# EAGLE design schematic (EAGLE 8.6.3)

## Sheet 1 of 2: BIG PCB -NRF52832 WLCSP (WIRED)
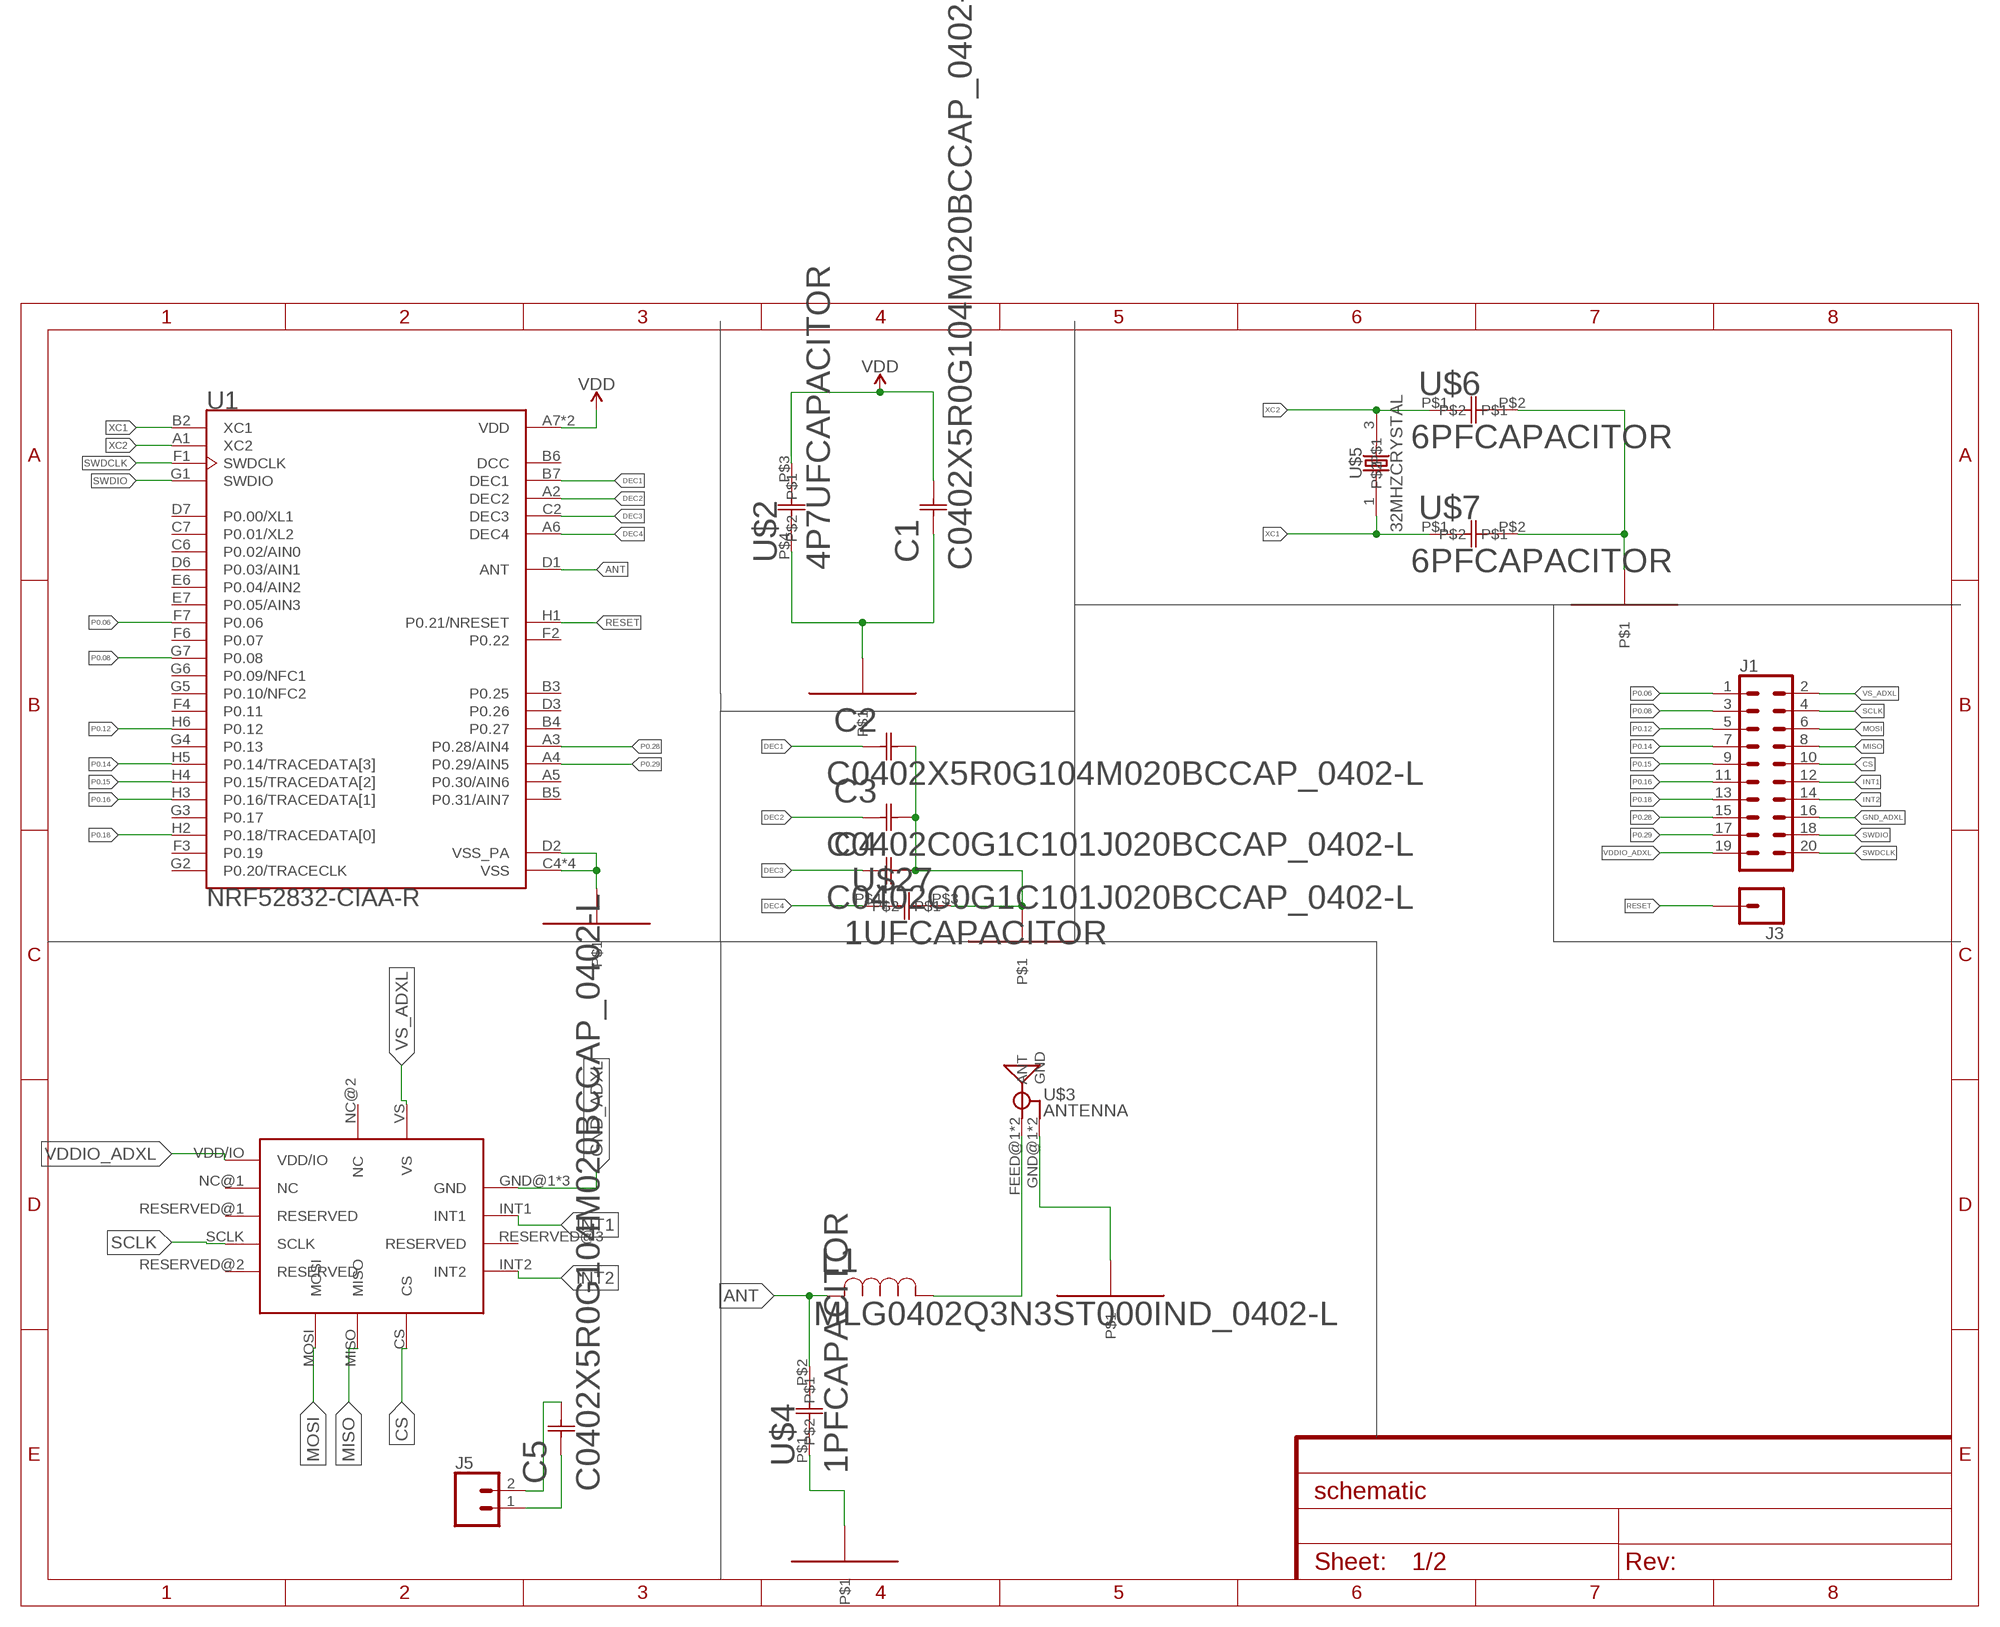
[diagram p0: schematic, sheet 1]

### Parts
C1  C0402X5R0G104M020BCCAP_0402-L  [CAP_0402-L]
C2  C0402X5R0G104M020BCCAP_0402-L  [CAP_0402-L]
C3  C0402C0G1C101J020BCCAP_0402-L  [CAP_0402-L]
C4  C0402C0G1C101J020BCCAP_0402-L  [CAP_0402-L]
C5  C0402X5R0G104M020BCCAP_0402-L  [CAP_0402-L]
J1  CONN_10X2  [2X10]
J3  CONN_01  [1X01]
J5  CONN_02  [1X02]
L1  MLG0402Q3N3ST000IND_0402-L  [IND_0402-L]
U1  NRF52832-CIAA-R  [BGA50N40P7X8_300X320X40]
U$1  ADXL362  [TFLGA-16/3.3MMX3.1MM]
U$2  4P7UFCAPACITOR  [4P7UFCAPACITOR]
U$3  ANTENNA  [ANTENNA_FOOTPRINT]
U$4  1PFCAPACITOR  [1PFCAPACITOR]
U$5  32MHZCRYSTAL  [32MHZCRYSTAL]
U$6  6PFCAPACITOR  [6PFCAPACITOR]
U$7  6PFCAPACITOR  [6PFCAPACITOR]
U$27  1UFCAPACITOR  [1UFCAPACITOR]

### Nets
ANT: L1.2 U1.D1(ANT) U$4.P$2
CS: J1.10 U$1.CS
DEC1: C2.1 U1.B7(DEC1)
DEC2: C3.1 U1.A2(DEC2)
DEC3: C4.1 U1.C2(DEC3)
DEC4: U1.A6(DEC4) U$27.P$4
GND_ADXL: J1.16 U$1.GND@1(GND) U$1.GND@2(GND) U$1.GND@3(GND)
INT1: J1.12 U$1.INT1
INT2: J1.14 U$1.INT2
MISO: J1.8 U$1.MISO
MOSI: J1.6 U$1.MOSI
N$1: L1.1 U$3.FEED@1(ANT) U$3.FEED@2(ANT)
N$3: C5.2 J5.2
N$4: C5.1 J5.1
P0.06: J1.1 U1.F7(P0.06)
P0.08: J1.3 U1.G7(P0.08)
P0.12: J1.5 U1.H6(P0.12)
P0.14: J1.7 U1.H5(P0.14/TRACEDATA[3])
P0.15: J1.9 U1.H4(P0.15/TRACEDATA[2])
P0.16: J1.11 U1.H3(P0.16/TRACEDATA[1])
P0.18: J1.13 U1.H2(P0.18/TRACEDATA[0])
P0.28: J1.15 U1.A3(P0.28/AIN4)
P0.29: J1.17 U1.A4(P0.29/AIN5)
P$1: C1.1 C2.2 C3.2 C4.2 U1.C4(VSS) U1.C5(VSS) U1.D2(VSS_PA) U1.E3(VSS) U1.F5(VSS) U$2.P$4 U$6.P$2 U$7.P$2 U$27.P$3 ; supply symbol labelled GND-SMALLPCB
RESET: J3.1 U1.H1(P0.21/NRESET)
SCLK: J1.4 U$1.SCLK
SWDCLK: J1.20 U1.F1(SWDCLK)
SWDIO: J1.18 U1.G1(SWDIO)
VDD: C1.2 U1.A7(VDD) U1.H7(VDD) U$2.P$3
VDDIO_ADXL: J1.19 U$1.VDD/IO
VS_ADXL: J1.2 U$1.VS
VSS_PA: U$3.GND@1(GND) U$3.GND@2(GND) U$4.P$1 ; supply symbol labelled GND-SMALLPCB
XC1: U1.B2(XC1) U$5.1 U$7.P$1
XC2: U1.A1(XC2) U$5.3 U$6.P$1
Unconnected: U1.A5(P0.30/AIN6) U1.B3(P0.25) U1.B4(P0.27) U1.B5(P0.31/AIN7) U1.C6(P0.02/AIN0) U1.C7(P0.01/XL2) U1.D3(P0.26) U1.D6(P0.03/AIN1) U1.D7(P0.00/XL1) U1.E6(P0.04/AIN2) U1.E7(P0.05/AIN3) U1.F2(P0.22) U1.F3(P0.19) U1.F4(P0.11) U1.F6(P0.07) U1.G2(P0.20/TRACECLK) U1.G3(P0.17) U1.G4(P0.13) U1.G5(P0.10/NFC2) U1.G6(P0.09/NFC1) U$1.NC@1(NC) U$1.NC@2(NC) U$1.RESERVED@1(RESERVED) U$1.RESERVED@2(RESERVED) U$1.RESERVED@3(RESERVED)

## Sheet 2 of 2
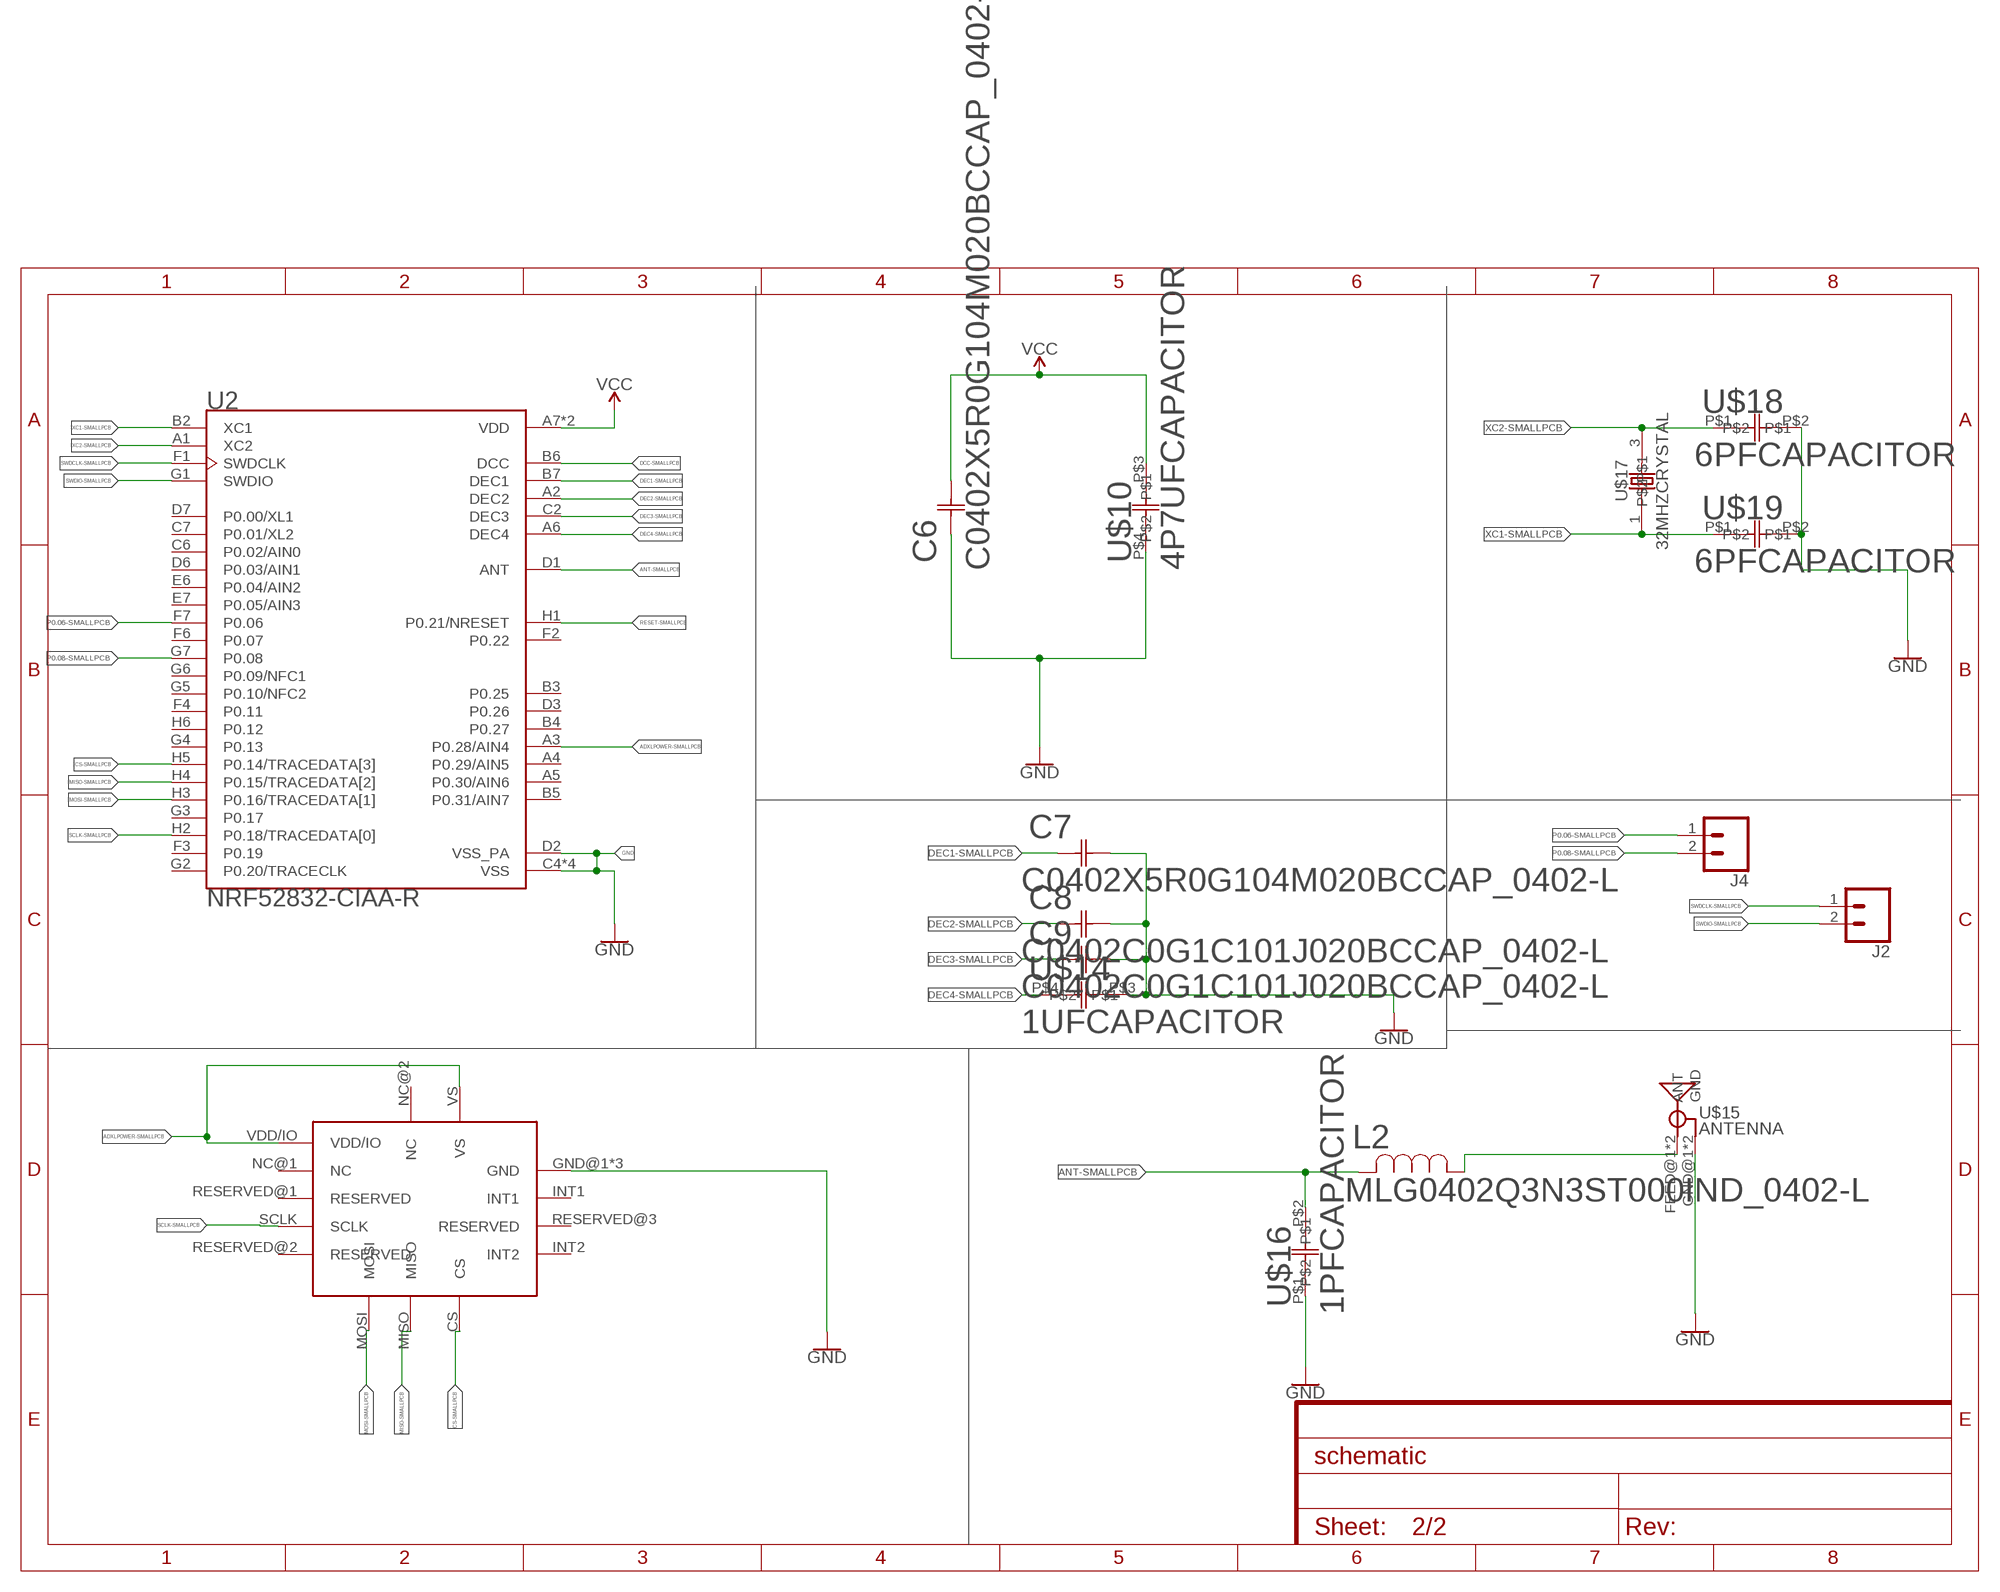
[diagram p1: schematic, sheet 2]

### Parts
C6  C0402X5R0G104M020BCCAP_0402-L  [CAP_0402-L]
C7  C0402X5R0G104M020BCCAP_0402-L  [CAP_0402-L]
C8  C0402C0G1C101J020BCCAP_0402-L  [CAP_0402-L]
C9  C0402C0G1C101J020BCCAP_0402-L  [CAP_0402-L]
J2  CONN_02  [1X02]
J4  CONN_02  [1X02]
L2  MLG0402Q3N3ST000IND_0402-L  [IND_0402-L]
U2  NRF52832-CIAA-R  [BGA50N40P7X8_300X320X40]
U$8  ADXL362  [TFLGA-16/3.3MMX3.1MM]
U$10  4P7UFCAPACITOR  [4P7UFCAPACITOR]
U$14  1UFCAPACITOR  [1UFCAPACITOR]
U$15  ANTENNA  [ANTENNA_FOOTPRINT]
U$16  1PFCAPACITOR  [1PFCAPACITOR]
U$17  32MHZCRYSTAL  [32MHZCRYSTAL]
U$18  6PFCAPACITOR  [6PFCAPACITOR]
U$19  6PFCAPACITOR  [6PFCAPACITOR]

### Nets
ADXLPOWER-SMALLPCB: U2.A3(P0.28/AIN4) U$8.VDD/IO U$8.VS
ANT-SMALLPCB: L2.2 U2.D1(ANT) U$16.P$2
CS-SMALLPCB: U2.H5(P0.14/TRACEDATA[3]) U$8.CS
DCC-SMALLPCB: U2.B6(DCC)
DEC1-SMALLPCB: C7.1 U2.B7(DEC1)
DEC2-SMALLPCB: C8.1 U2.A2(DEC2)
DEC3-SMALLPCB: C9.1 U2.C2(DEC3)
DEC4-SMALLPCB: U2.A6(DEC4) U$14.P$4
GND: C6.1 C7.2 C8.2 C9.2 U2.C4(VSS) U2.C5(VSS) U2.D2(VSS_PA) U2.E3(VSS) U2.F5(VSS) U$8.GND@1(GND) U$8.GND@2(GND) U$8.GND@3(GND) U$10.P$4 U$14.P$3 U$15.GND@1(GND) U$15.GND@2(GND) U$16.P$1 U$18.P$2 U$19.P$2
MISO-SMALLPCB: U2.H4(P0.15/TRACEDATA[2]) U$8.MISO
MOSI-SMALLPCB: U2.H3(P0.16/TRACEDATA[1]) U$8.MOSI
N$2: L2.1 U$15.FEED@1(ANT) U$15.FEED@2(ANT)
P0.06-SMALLPCB: J4.1 U2.F7(P0.06)
P0.08-SMALLPCB: J4.2 U2.G7(P0.08)
RESET-SMALLPCB: U2.H1(P0.21/NRESET)
SCLK-SMALLPCB: U2.H2(P0.18/TRACEDATA[0]) U$8.SCLK
SWDCLK-SMALLPCB: J2.1 U2.F1(SWDCLK)
SWDIO-SMALLPCB: J2.2 U2.G1(SWDIO)
VCC: C6.2 U2.A7(VDD) U2.H7(VDD) U$10.P$3
XC1-SMALLPCB: U2.B2(XC1) U$17.1 U$19.P$1
XC2-SMALLPCB: U2.A1(XC2) U$17.3 U$18.P$1
Unconnected: U2.A4(P0.29/AIN5) U2.A5(P0.30/AIN6) U2.B3(P0.25) U2.B4(P0.27) U2.B5(P0.31/AIN7) U2.C6(P0.02/AIN0) U2.C7(P0.01/XL2) U2.D3(P0.26) U2.D6(P0.03/AIN1) U2.D7(P0.00/XL1) U2.E6(P0.04/AIN2) U2.E7(P0.05/AIN3) U2.F2(P0.22) U2.F3(P0.19) U2.F4(P0.11) U2.F6(P0.07) U2.G2(P0.20/TRACECLK) U2.G3(P0.17) U2.G4(P0.13) U2.G5(P0.10/NFC2) U2.G6(P0.09/NFC1) U2.H6(P0.12) U$8.INT1 U$8.INT2 U$8.NC@1(NC) U$8.NC@2(NC) U$8.RESERVED@1(RESERVED) U$8.RESERVED@2(RESERVED) U$8.RESERVED@3(RESERVED)

## Power pins joined to a net without a drawn wire
DCC: U1.B6(DCC)

## Library data of the parts
C1 C2 C5-C7 = 0p1_uF_capacitor:C0402X5R0G104M020BC; MANUFACTURER_PART_NUMBER: C0402C0G1C101J020BC; VENDOR: TDK
C3 C4 C8 C9 = 100_pF_capacitor:C0402C0G1C101J020BC; MANUFACTURER_PART_NUMBER: C0402C0G1C101J020BC; VENDOR: TDK
J1 = SparkFun-Connectors:CONN_10X2: Multi connection point. Often used as Generic Header-pin footprint for 0.1 inch spaced/style header connections On any of the 0.1 inch spaced packages, you can populate with these: Break Away Headers - Straight <https://www.sparkfun.com/products/116> (PRT-00116) Break Away Male Headers - Right Angle <https://www.sparkfun.com/products/553> (PRT-00553) Female Headers <https://www.sparkfun.com/products/115> (PRT-00115) Break Away Headers - Machine Pin <https://www.sparkfun.com/products/117> (PRT-00117) Break Away Female Headers - Swiss Machine Pin <https://www.sparkfun.com/products/743> (PRT-00743) Special note about the "SPECIAL" package: This was SPECIALLY designed to be used with our Graphic LCD Backpack. Be sure you want to use this! It is not only staggered on each line of header holes, but IT IS ALSO offset of the center point of the top and bottom lines by 5 mil. This causes the headers to lock into place on the "standard" footprint on the LCD screen. The extra squares on the tdocu layer are there simply to reference other pins (if you were to actually populate a longer header than ten long - this is what we do with the backpacks).
J2 J4 J5 = SparkFun-Connectors:CONN_02: Multi connection point. Often used as Generic Header-pin footprint for 0.1 inch spaced/style header connections On any of the 0.1 inch spaced packages, you can populate with these: Break Away Headers - Straight <https://www.sparkfun.com/products/116> (PRT-00116) Break Away Male Headers - Right Angle <https://www.sparkfun.com/products/553> (PRT-00553) Female Headers <https://www.sparkfun.com/products/115> (PRT-00115) Break Away Headers - Machine Pin <https://www.sparkfun.com/products/117> (PRT-00117) Break Away Female Headers - Swiss Machine Pin <https://www.sparkfun.com/products/743> (PRT-00743) For SCREWTERMINALS and SPRING TERMINALS visit here: Screw Terimnals on SparkFun.com <https://www.sparkfun.com/search/results?term=Screw+Terminals> (5mm/3.5mm/2.54mm spacing) This device is also useful as a general connection point to wire up your design to another part of your project. Our various solder wires solder well into these plated through hole pads. Hook-Up Wire - Assortment (Stranded, 22 AWG) <https://www.sparkfun.com/products/11375> (PRT-11375) Hook-Up Wire - Assortment (Solid Core, 22 AWG) <https://www.sparkfun.com/products/11367> (PRT-11367) View the entire wire category on our website here <https://www.sparkfun.com/categories/141> Special notes: Molex polarized connector foot print use with: PRT-08233 with associated crimp pins and housings. 2.54_SCREWTERM for use with PRT-10571. 3.5mm Screw Terminal footprints for PRT-08084 5mm Screw Terminal footprints for use with PRT-08432
J3 = SparkFun-Connectors:CONN_01: Single connection point. Often used as Generic Header-pin footprint for 0.1 inch spaced/style header connections On any of the 0.1 inch spaced packages, you can populate with these: Break Away Headers - Straight <https://www.sparkfun.com/products/116> (PRT-00116) Break Away Male Headers - Right Angle <https://www.sparkfun.com/products/553> (PRT-00553) Female Headers <https://www.sparkfun.com/products/115> (PRT-00115) Break Away Headers - Machine Pin <https://www.sparkfun.com/products/117> (PRT-00117) Break Away Female Headers - Swiss Machine Pin <https://www.sparkfun.com/products/743> (PRT-00743) This device is also useful as a general connection point to wire up your design to another part of your project. Our various solder wires solder well into these plated through hole pads. Hook-Up Wire - Assortment (Stranded, 22 AWG) <https://www.sparkfun.com/products/11375> (PRT-11375) Hook-Up Wire - Assortment (Solid Core, 22 AWG) <https://www.sparkfun.com/products/11367> (PRT-11367) View the entire wire category on our website here <https://www.sparkfun.com/categories/141> Special notes: SMTSO-256-ET is a "flush mount" nut for a 4-40 screw. We mostly use this on specialty testbeds; it is a nice way to connect hardware to your PCB at an adjustable hieght. Also note, the SNAP packages are for using a snappable style connector. We sell a baggie of snaps and they are also used on two LilyPad designs: Snap Assortment - 30 pack (male and female) <https://www.sparkfun.com/products/11347> (DEV-11347) LilyPad Arduino SimpleSnap <https://www.sparkfun.com/products/10941> (DEV-10941) LilyPad SimpleSnap Protoboard <https://www.sparkfun.com/products/10940> (DEV-10940)
L1 L2 = 3p3_nH_inductor:MLG0402Q3N3ST000; MANUFACTURER_PART_NUMBER: MLG0402Q3N3ST000; VENDOR: TDK
U1 U2 = NRF52832-CIAA-R:NRF52832-CIAA-R: Multi Protocal Bluetooth Smart ANT 2.4GHz RF SoC (WL-CSP); AVAILABILITY: Good; DESCRIPTION: IC RF TXRX+MCU BLUETOOTH 50WLCSP; MF: Nordic; MP: NRF52832-CIAA-R; PACKAGE: XFBGA-50 Nordic Semiconductor; PRICE: 3.87 USD
U$1 U$8 = ADXL362:ADXL362
U$2 U$10 = 4p7_uF_capacitor:4P7UFCAPACITOR
U$3 U$15 = 2p4_ghz_antenna:ANTENNA
U$4 U$16 = 1_pF_capacitor:1PFCAPACITOR
U$5 U$17 = 32_mhz_crystal:32MHZCRYSTAL
U$6 U$7 U$18 U$19 = 6_pF_capacitor:6PFCAPACITOR
U$14 U$27 = 1_uF_capacitor:1UFCAPACITOR

## Board
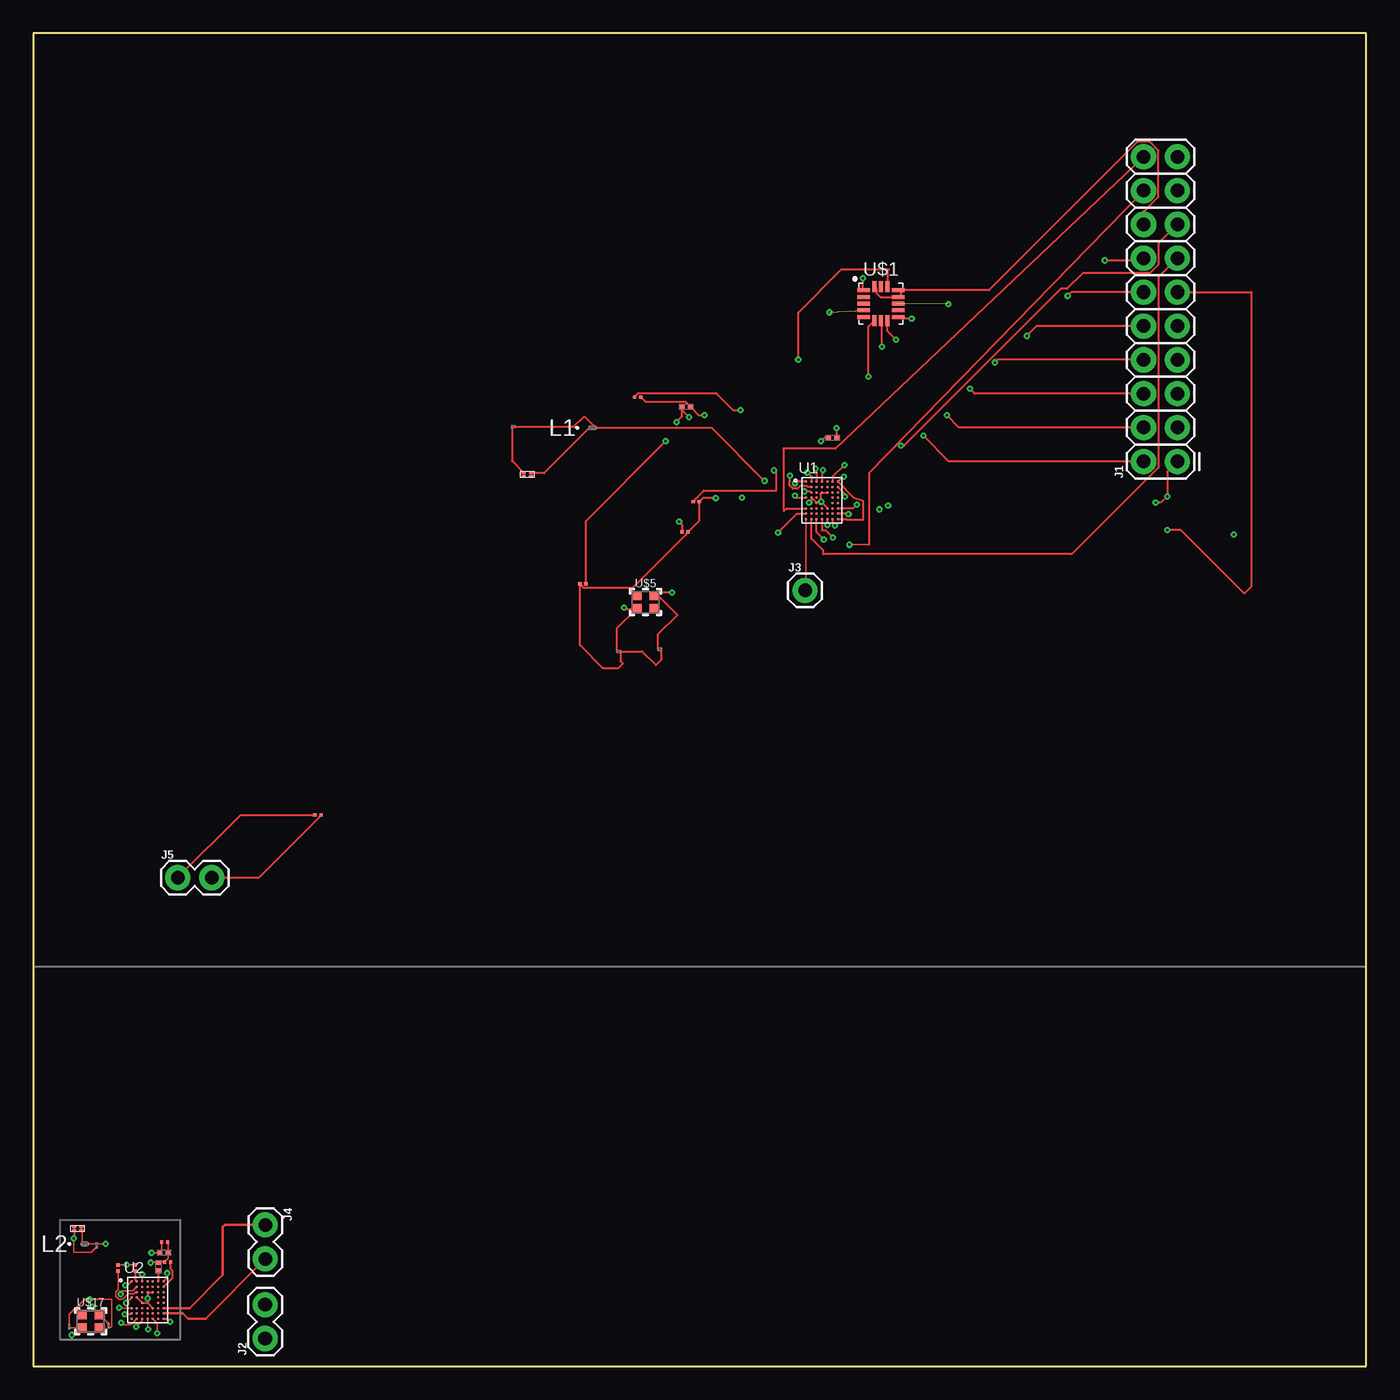
[diagram p2: board, top side]
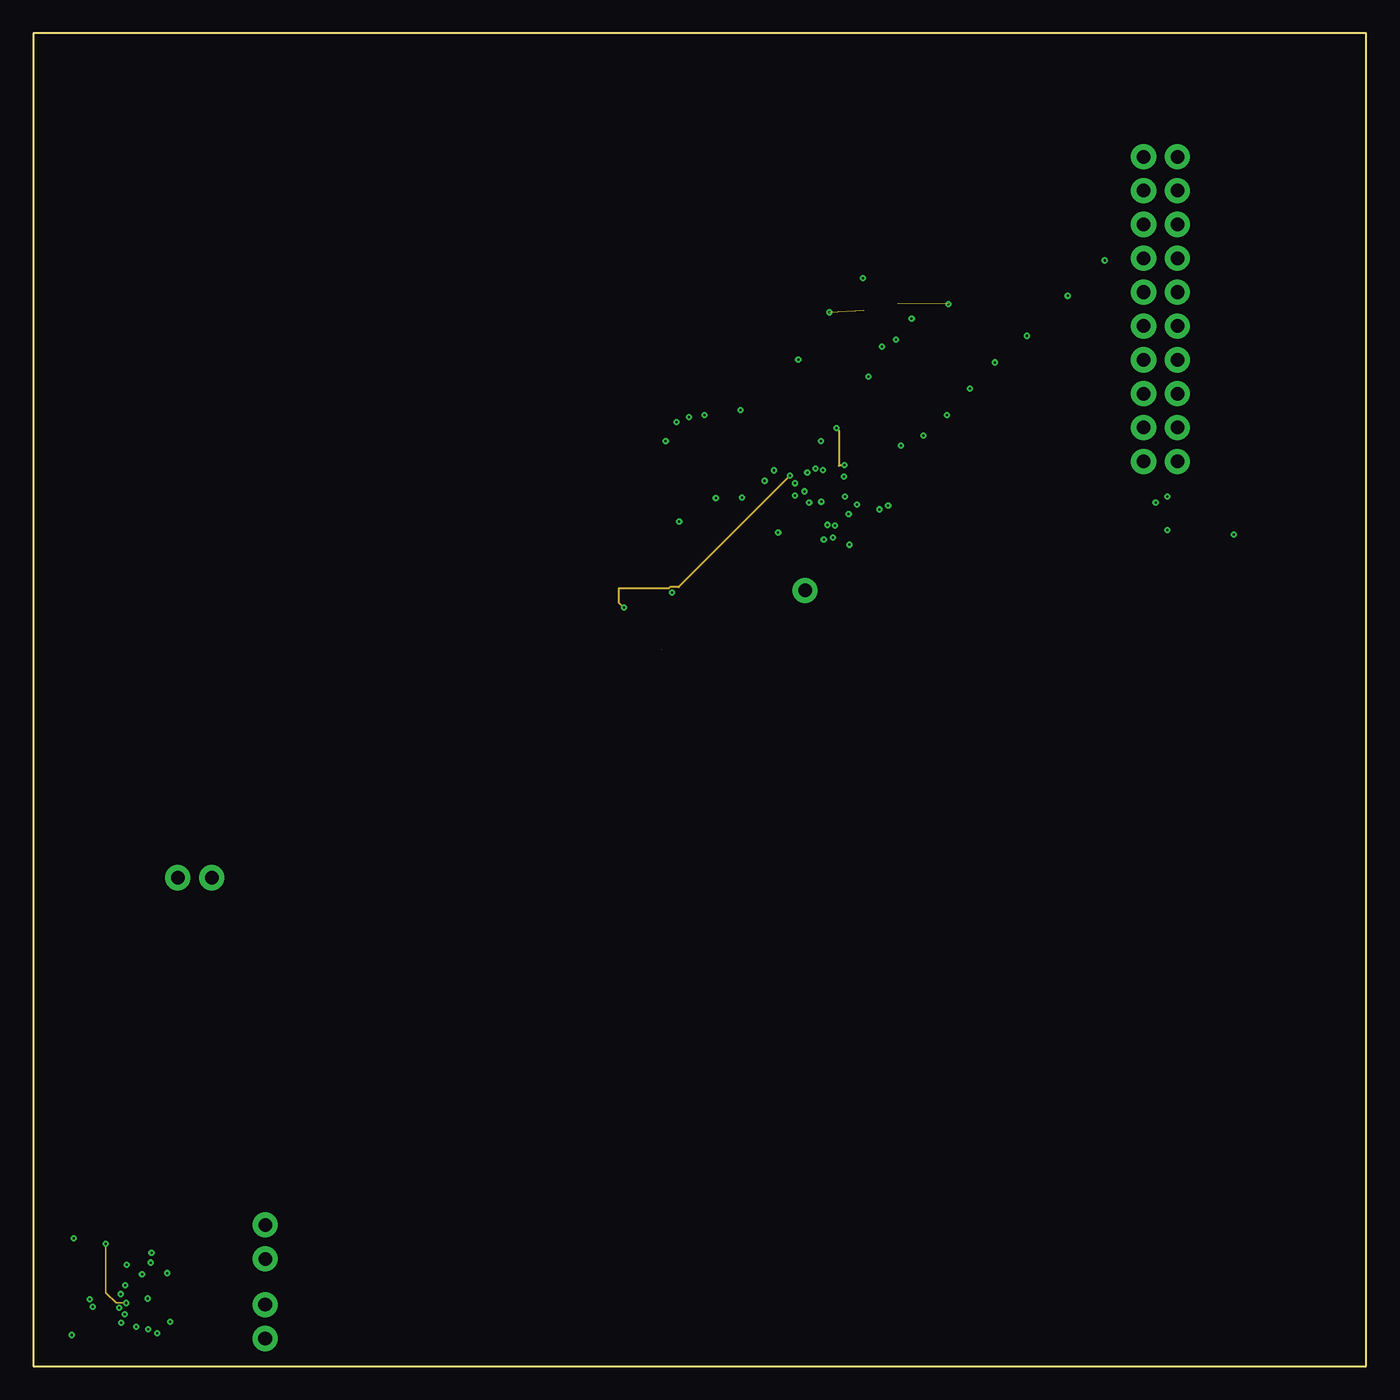
[diagram p3: board, inner layer Route4]
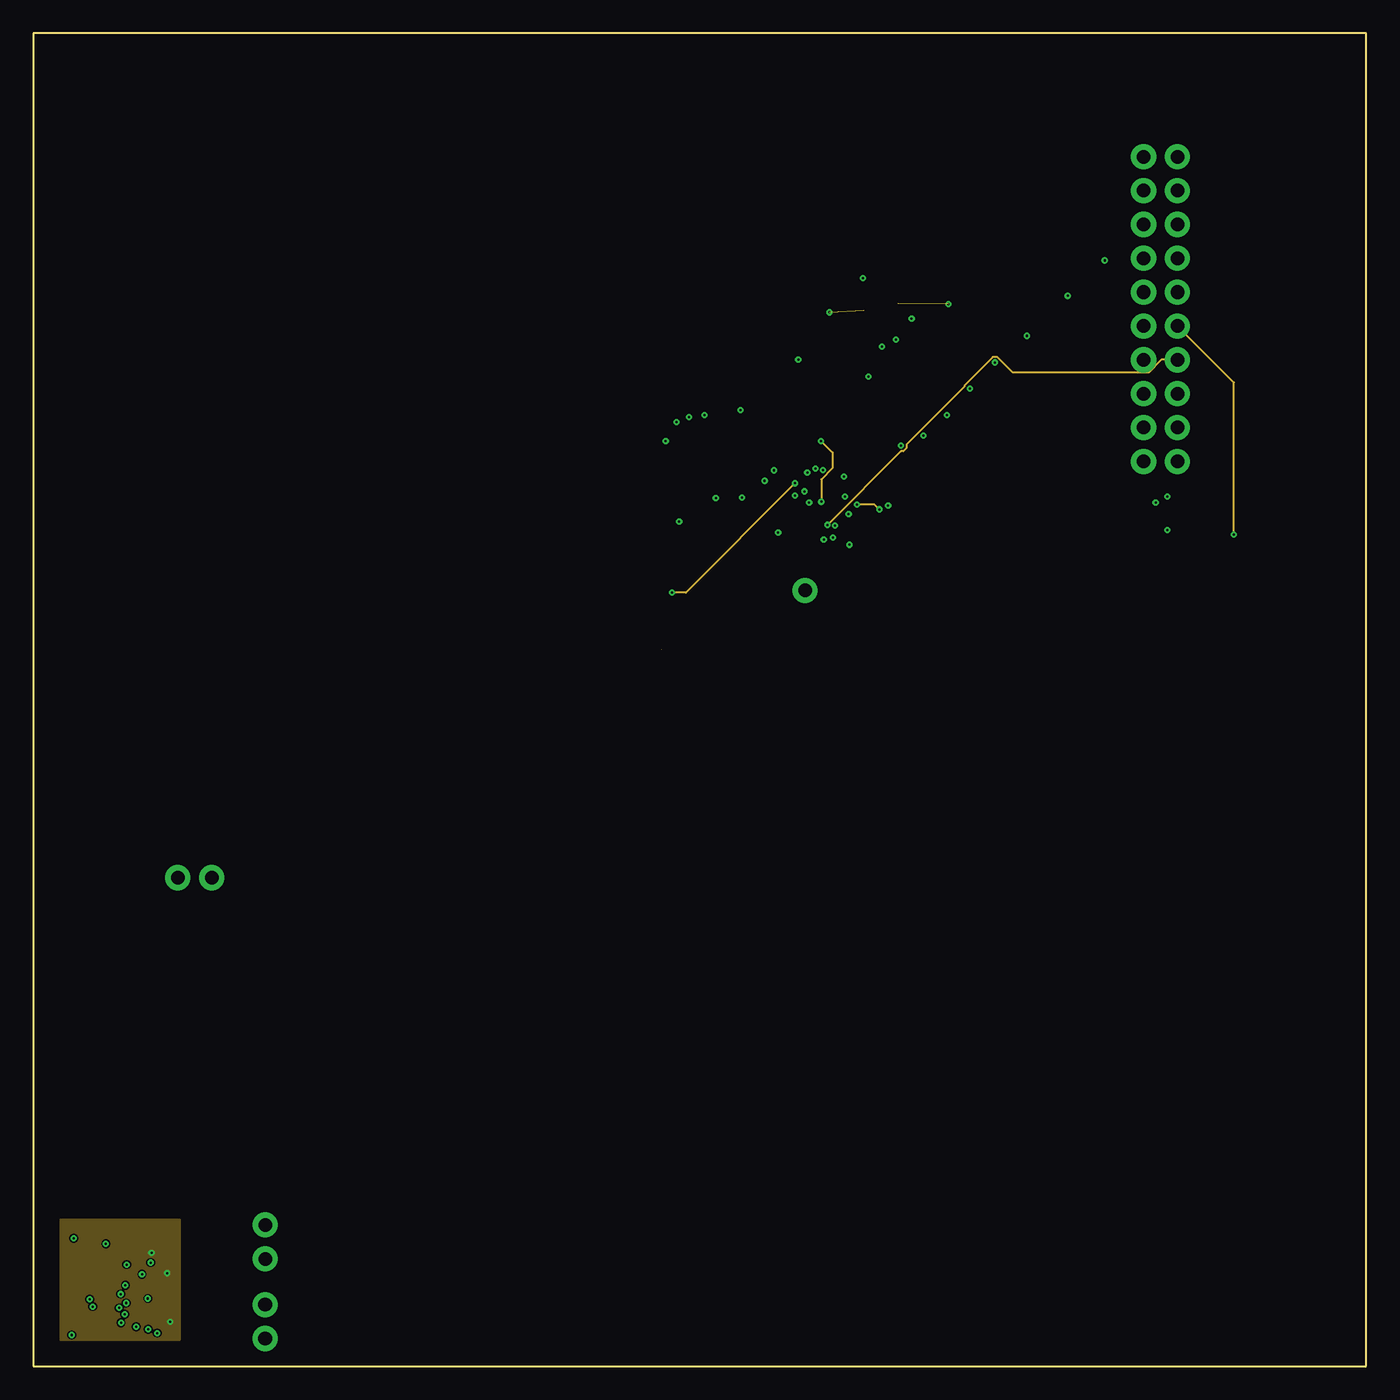
[diagram p4: board, inner layer Route8]
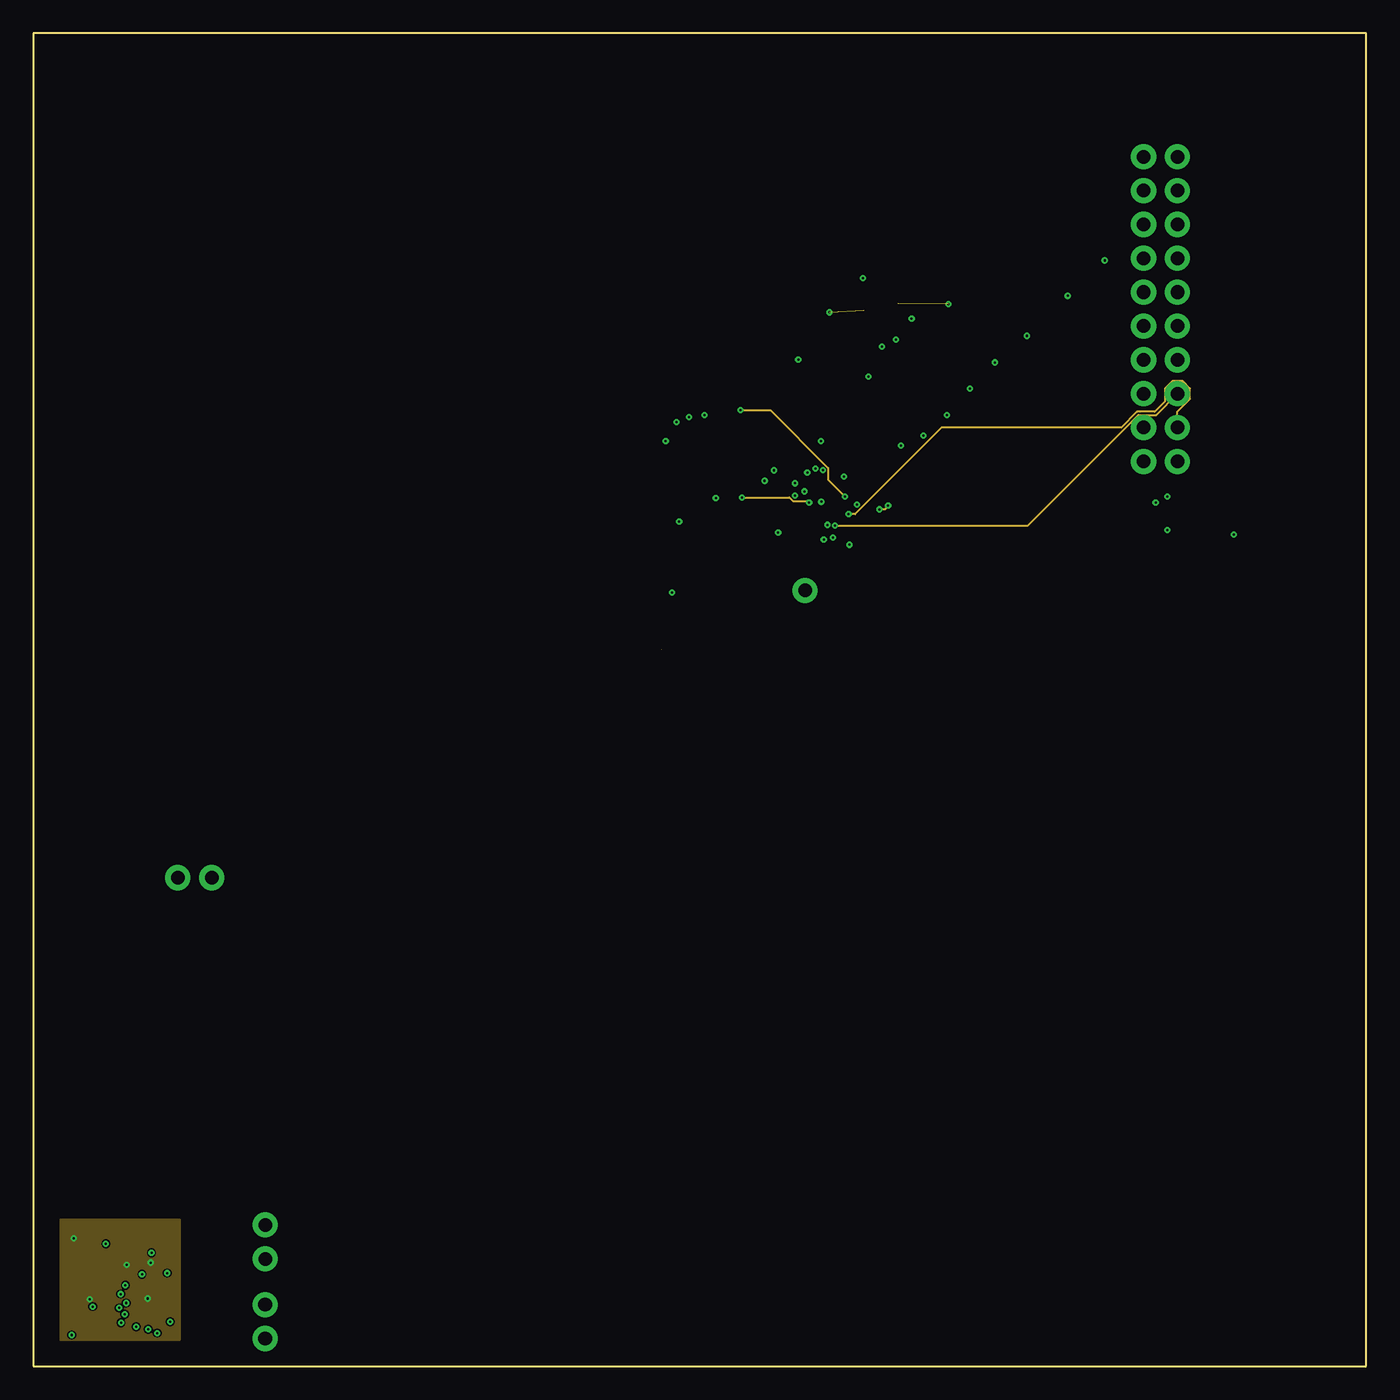
[diagram p5: board, inner layer Route10]
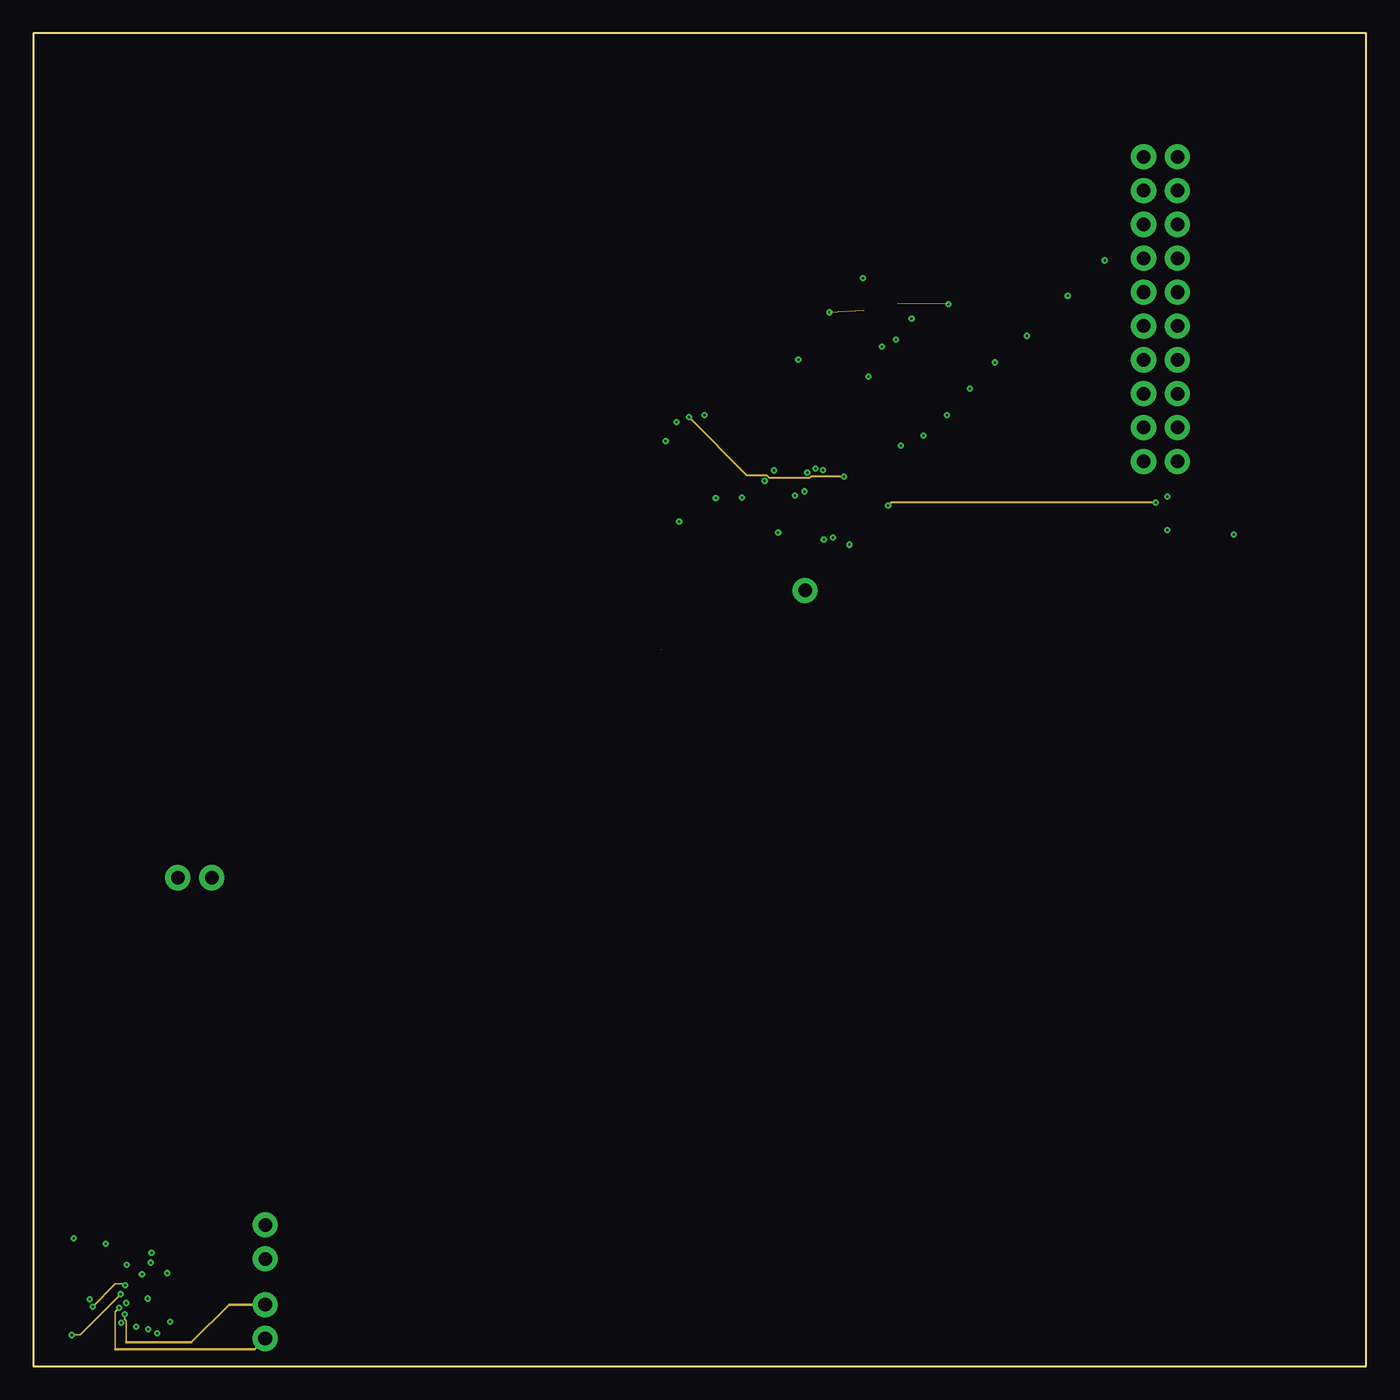
[diagram p6: board, inner layer Route12]
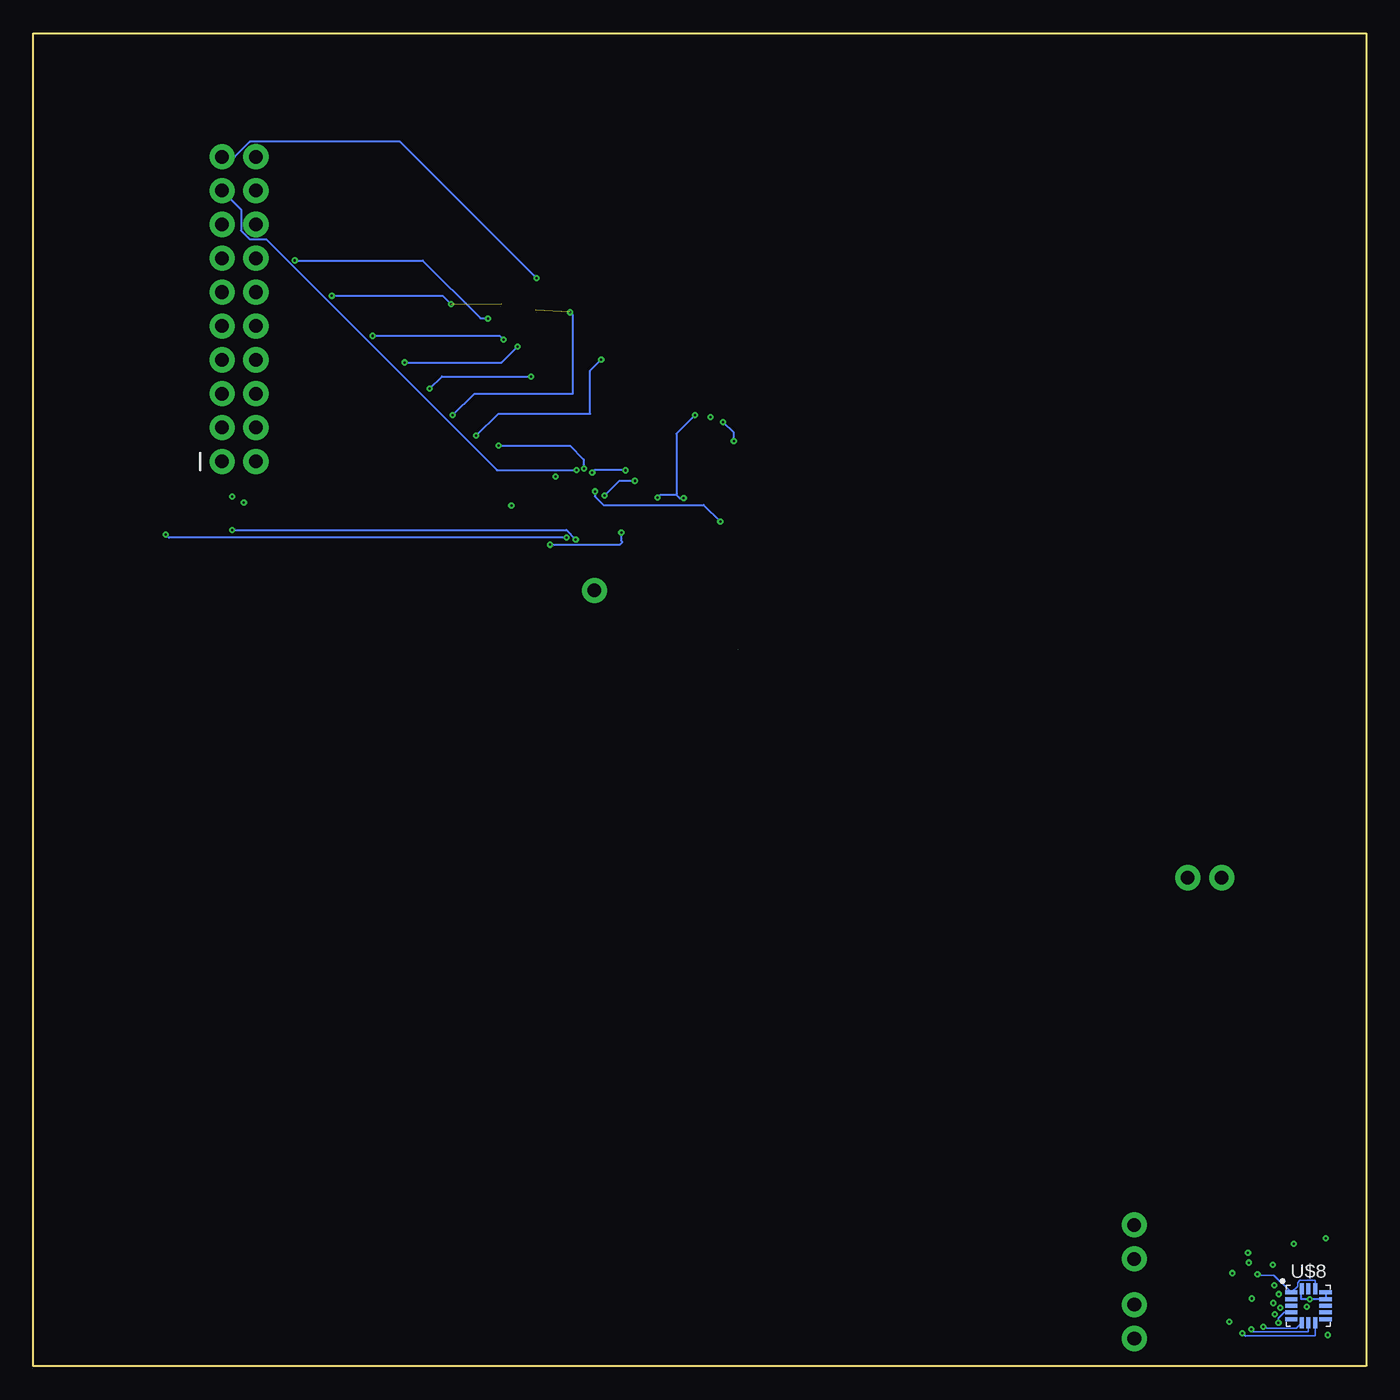
[diagram p7: board, bottom side, seen from below]

Size 100 x 100 mm. Coordinates in mm from the lower left corner, seen from the top.
Outline: 0,0 100,0 100,100 0,100 0,0
Copper layers (((1*4)*8*10)*(12*16)): Top 0.035mm / dielectric 0.25mm / Route4 0.035mm / dielectric 0.31mm / Route8 0.035mm / dielectric 0.15mm / Route10 0.035mm / dielectric 0.15mm / Route12 0.035mm / dielectric 0.15mm / Bottom 0.035mm
Design rules "default *": minimum track width 4mil, minimum drill 6mil, track to track 4mil, track to pad 4mil, pad to pad 4mil, via to via 4mil, smd to smd 2mil, copper to edge 40mil, drill to drill 6mil, minimum pad ring 10mil, minimum via ring 6mil, stop-mask expansion 4mil, vias tented up to drill 0mil, thermal gap 10mil

### Footprints (pad centres in the part's own frame; a part is rotated, then mirrored left to right if it is on the bottom)
CAP_0402-L = smd 0.25 x 0.25: 1 -0.229,0; 2 0.229,0
2X10 = drill 1.016 pad 1.88: 1 0,0; 2 0,2.54; 3 2.54,0; 4 2.54,2.54; 5 5.08,0; 6 5.08,2.54; 7 7.62,0; 8 7.62,2.54; 9 10.16,0; 10 10.16,2.54; 11 12.7,0; 12 12.7,2.54; 13 15.24,0; 14 15.24,2.54; 15 17.78,0; 16 17.78,2.54; 17 20.32,0; 18 20.32,2.54; 19 22.86,0; 20 22.86,2.54
1X02 = drill 1.016 pad 1.88: 1 0,0; 2 2.54,0
1X01 = drill 1.016 pad 1.88: 1 0,0
IND_0402-L = smd 0.212 x 0.2: 1 -0.196,0; 2 0.196,0
BGA50N40P7X8_300X320X40 = smd 0.2 x 0.2: A1 -1.2,1.4; A2 -0.8,1.4; A3 -0.4,1.4; A4 0,1.4; A5 0.4,1.4; A6 0.8,1.4; A7 1.2,1.4; B2 -0.8,1; B3 -0.4,1; B4 0,1; B5 0.4,1; B6 0.8,1; B7 1.2,1; C2 -0.8,0.6; C3 -0.4,0.6; C4 0,0.6; C5 0.4,0.6; C6 0.8,0.6; C7 1.2,0.6; D1 -1.2,0.2; D2 -0.8,0.2; D3 -0.4,0.2; D6 0.8,0.2; D7 1.2,0.2; E3 -0.4,-0.2; E6 0.8,-0.2; E7 1.2,-0.2; F1 -1.2,-0.6; F2 -0.8,-0.6; F3 -0.4,-0.6; F4 0,-0.6; F5 0.4,-0.6; F6 0.8,-0.6; F7 1.2,-0.6; G1 -1.2,-1; G2 -0.8,-1; G3 -0.4,-1; G4 0,-1; G5 0.4,-1; G6 0.8,-1; G7 1.2,-1; H1 -1.2,-1.4; H2 -0.8,-1.4; H3 -0.4,-1.4; H4 0,-1.4; H5 0.4,-1.4; H6 0.8,-1.4; H7 1.2,-1.4
TFLGA-16/3.3MMX3.1MM = smd 0.3 x 0.8: CS 0.5,-1.275; GND@3 -0.5,1.275; MISO 0,-1.275; MOSI -0.5,-1.275; NC@2 0,1.275; VS 0.5,1.275 | smd 0.925 x 0.3: GND@1 1.288,0.5; GND@2 1.288,1; INT1 1.288,0; INT2 1.288,-1; NC@1 -1.288,0.5; RESERVED@1 -1.288,0; RESERVED@2 -1.288,-1; RESERVED@3 1.288,-0.5; SCLK -1.288,-0.5; VDD/IO -1.288,1
4P7UFCAPACITOR = smd 0.35 x 0.4: P$3 0.18,0.15; P$4 0.8,0.15
ANTENNA_FOOTPRINT = smd 0.3 x 0.2: FEED@1 0.77,0.1; FEED@2 0.77,0.4; GND@1 0.23,0.1; GND@2 0.23,0.4
1PFCAPACITOR = smd 0.125 x 0.15: P$1 0.034,0.075; P$2 0.27,0.075
32MHZCRYSTAL = smd 0.75 x 0.7: 1 0.485,0.47; 2 1.835,0.47; 3 1.835,1.47; 4 0.485,1.47
6PFCAPACITOR = smd 0.125 x 0.15: P$1 0.034,0.075; P$2 0.27,0.075
1UFCAPACITOR = smd 0.35 x 0.4: P$3 0.18,0.15; P$4 0.8,0.15

### Placement (x,y rotation side)
C1  41.23,58.71 0 top
C2  45.34,72.71 0 top
C3  49.74,64.87 0 top
C4  48.9,62.59 0 top
C5  21.36,41.35 0 top
C6  9.86,9.32 180 top
C7  10.08,7.82 180 top
C8  7.65,7.37 90 top
C9  6.35,7.37 90 top
J1  85.84,67.88 90 top
J2  17.39,2.07 90 top
J3  57.91,58.21 0 top
J4  17.41,10.59 270 top
J5  10.85,36.65 0 top
L1  41.94,70.41 0 top
L2  3.85,9.18 0 top
U1  59.17,64.96 0 top
U2  8.56,4.96 0 top
U$1  63.6,79.71 0 top
U$2  48.5,71.83 0 top
U$3  36.56,66.65 0 top
U$4  35.87,70.41 0 top
U$5  44.77,56.35 0 top
U$6  46.85,53.71 0 top
U$7  43.77,53.56 0 top
U$8  4.33,4.53 0 bottom
U$10  9.32,8.37 0 top
U$14  9.24,7.96 270 top
U$15  2.82,10.08 0 top
U$16  4.82,8.92 90 top
U$17  3.14,2.4 0 top
U$18  5.58,3.17 270 top
U$19  2.76,2.83 90 top
U$27  59.48,69.5 0 top

### Tracks (layer width: path | path; a pad name or v marks a point on that pad's centre or on a via)
ADXLPOWER-SMALLPCB  (via drill 0.15 pad 0.46)
  Top 0.102: v8.15,6.88 8.16,6.87 U2.A3
  Bottom 0.102: U$8.VS 3.83,6.42 3.83,6.43 4.97,6.43 5.13,6.26 5.13,6.01 U$8.VDD/IO 6.93,6.83 8.1,6.83 v8.15,6.88
ANT  (via drill 0.15)
  Top 0.152: U$4.P$2 40.55,70.48 41.3,71.24 41.37,71.24 42.03,70.58 42.03,70.51 L1.2 50.89,70.41 v54.87,66.42 | v57.15,65.33 57.32,65.16 U1.D1
  Bottom 0.152: v54.87,66.42 56.06,66.42 v57.15,65.33
ANT-SMALLPCB  (via drill 0.15)
  Top 0.102: L2.2 4.73,9.18 U$16.P$2 v5.45,9.19 | U2.D1 7.36,5.14 v6.96,4.74
  Route4 0.102: v6.96,4.74 6.62,4.74 6.61,4.75 6.29,4.75 6.21,4.75 5.45,5.51 v5.45,9.19
CS  (via drill 0.15)
  Top 0.152: J1.10 75.27,78.04 v74.53,77.3 | v64.73,77.02 64.1,77.65 U$1.CS
  Bottom 0.152: v74.53,77.3 65.02,77.3 v64.73,77.02
CS-SMALLPCB  (via drill 0.15)
  Top 0.127: v9.3,2.48 9.3,3.22 U2.H5
  Bottom 0.127: U$8.CS 3.83,2.27 3.84,2.27 9.03,2.27 9.04,2.26 9.26,2.48 v9.3,2.48
DEC1  (via drill 0.15 layers 1-10)
  Top 0.152: C2.1 45.27,72.86 45.27,72.91 45.38,73.02 51.22,73.02 52.51,71.73 v53.05,71.73 | v60.89,65.26 60.89,65.44 U1.B7
  Route10 0.152: v60.89,65.26 59.64,66.51 59.64,67.39 55.3,71.73 v53.05,71.73
DEC1-SMALLPCB
  Top 0.152: C7.1 10.31,7.3 10.45,7.16 10.45,6.65 U2.B7
DEC2  (via drill 0.15)
  Top 0.152: C3.1 49.67,65.03 49.67,65.07 50.31,65.71 55.75,65.71 55.75,67.04 v55.58,67.21 | v58.07,67.05 58.37,66.75 U1.A2
  Bottom 0.152: v55.58,67.21 57.91,67.21 v58.07,67.05
DEC2-SMALLPCB
  Top 0.152: C8.1 7.64,6.48 U2.A2
DEC3  (via drill 0.15)
  Top 0.152: U1.C2 58.3,65.64 v57.87,65.64 | v48.46,63.35 48.67,63.15 C4.1
  Bottom 0.152: v57.87,65.64 57.87,65.25 57.23,64.61 49.72,64.61 v48.46,63.35
DEC3-SMALLPCB
  Top 0.102: U2.C2 7.65,5.56 7.53,5.44 7.12,5.44 6.71,5.03 6.39,5.03 6.17,5.25 6.17,5.57 6.35,5.75 C9.1
DEC4  (via drill 0.15 layers 1-4)
  Top 0.152: U$27.P$4 60.28,70.33 v60.25,70.37 | v60.84,67.61 59.97,66.74 U1.A6
  Route4 0.152: v60.25,70.37 60.44,70.18 60.44,67.53 60.51,67.61 v60.84,67.61
DEC4-SMALLPCB
  Top 0.152: U$14.P$4 9.36,7.13 U2.A6
GND  (via drill 0.15, 0.15 pad 0.46)
  Top 0.102: U$18.P$2 5.68,2.92 5.8,2.92 5.89,3.01 5.89,5.02 5.89,5.03 v4.24,5.03 | v4.24,5.03 | U$19.P$2 2.69,3.88 3.19,4.37 3.21,4.37 3.86,5.03 v4.24,5.03 | C8.2 7.62,7.62 v7.01,7.62 6.99,7.59 C9.2 | v8.81,7.77 v8.82,7.78 U$14.P$3 9.43,7.82 C7.2 10.04,8 10.04,8.01 10.12,8.1 U$10.P$4 10.12,9.28 C6.1 | U$16.P$1 4.33,8.54 4.03,8.54 3.98,8.54 3.05,8.54 3.02,8.57 3.04,8.59 v3.04,9.59
  Top 0.152: 8.56,4.76 U2.E3 U2.D2 | 8.56,4.76 U2.F5 | U2.C5 U2.C4 8.56,4.97 | 8.56,4.97 8.56,4.76 | 8.56,4.97 8.6,5 v8.6,5.08 | U$15.GND@2 U$15.GND@1 3.05,9.6 v3.04,9.59
  Route10 0.152: v8.6,5.08 8.67,5.08 | v3.04,9.59
  Bottom 0.152: U$8.GND@2 U$8.GND@1 v4.24,5.03 4.86,5.03 4.88,5.04 4.88,5.76 U$8.GND@3
  pour Route10: 2,2 11,2 11,11 2,11
GND_ADXL
  Top 0.152: 65.11,80.72 71.69,80.72 82.84,91.86 83.77,91.86 84.42,91.2 84.42,87.74 83.3,86.62 J1.16 | 65.11,80.72 U$1.GND@2 | 65.11,80.72 65.11,80.44 U$1.GND@1 63.57,80.22 63.27,80.52 63.27,80.82 U$1.GND@3
INT1  (via drill 0.15)  (1 unrouted)
  Top 0.152: J1.12 77.88,80.58 v77.6,80.3
  Bottom 0.152: v77.6,80.3 69.3,80.3 v68.67,79.68
INT2  (via drill 0.15)
  Top 0.152: J1.14 83.14,82.96 v80.38,82.96 | v65.9,78.59 65.01,78.59 U$1.INT2
  Bottom 0.152: v80.38,82.96 70.79,82.96 66.45,78.62 65.93,78.62 v65.9,78.59
MISO  (via drill 0.15)
  Top 0.152: J1.8 72.35,75.5 v72.16,75.31 | v63.68,76.5 63.68,78.36 U$1.MISO
  Bottom 0.152: v72.16,75.31 64.87,75.31 v63.68,76.5
MISO-SMALLPCB  (via drill 0.15 pad 0.46)
  Top 0.102: v8.61,2.77 8.56,2.81 U2.H4
  Bottom 0.102: U$8.MISO 4.33,2.58 4.34,2.56 8.59,2.56 8.61,2.59 v8.61,2.77
MOSI  (via drill 0.15)
  Top 0.152: J1.6 70.64,72.96 v70.26,73.33 | v62.65,74.26 62.65,78 U$1.MOSI
  Bottom 0.152: v70.26,73.33 69.34,74.26 v62.65,74.26
MOSI-SMALLPCB  (via drill 0.15 pad 0.46)
  Top 0.102: v7.72,2.95 8.16,3.39 U2.H3
  Bottom 0.102: U$8.MOSI 5.24,2.85 7.44,2.85 7.54,2.95 v7.72,2.95
N$1
  Top 0.152: U$3.FEED@2 37.33,66.99 | 37.33,66.99 U$3.FEED@1 | L1.1 38.33,66.99 37.33,66.99
N$2
  Top 0.102: U$15.FEED@2 U$15.FEED@1 3.65,10.11 L2.1
N$3
  Top 0.152: C5.2 21.44,41.2 21.44,41.15 16.93,36.65 J5.2
N$4
  Top 0.152: J5.1 15.54,41.35 C5.1
P0.06  (via drill 0.15, 0.15 layers 1-10)
  Top 0.152: J1.1 85.07,67.11 v85.07,65.26 84.61,64.79 v84.2,64.79 | v61.78,64.64 61.51,64.36 U1.F7
  Route8 0.152: v63.47,64.28 63.12,64.64 v61.78,64.64
  Route10 0.152: v64.14,64.56 63.86,64.28 v63.47,64.28
  Route12 0.152: v84.2,64.79 64.37,64.79 v64.14,64.56
P0.06-SMALLPCB
  Top 0.203: U2.F7 11.72,4.36 14.22,6.86 14.22,10.44 14.38,10.59 J4.1
P0.08  (via drill 0.15 layers 1-10)
  Top 0.152: v61.17,63.94 61.15,63.96 U1.G7
  Route10 0.152: J1.3 85.84,71.63 86.78,72.57 86.78,73.35 86.23,73.9 85.45,73.9 84.9,73.35 84.9,72.38 84.14,71.61 82.81,71.61 81.61,70.42 68.14,70.42 61.65,63.93 61.19,63.93 v61.17,63.94
P0.08-SMALLPCB
  Top 0.203: U2.G7 11.21,3.96 11.61,3.56 12.91,3.56 J4.2
P0.12  (via drill 0.15 layers 1-10)
  Top 0.152: U1.H6 59.97,63.3 59.98,63.29 59.98,63.21 v60.14,63.06
  Route10 0.152: J1.5 84.24,71.36 82.91,71.36 74.61,63.06 v60.14,63.06
P0.14  (via drill 0.15 layers 1-10)
  Top 0.152: v59.58,63.12 U1.H5
  Route8 0.152: v59.58,63.12 65.11,68.65 65.27,68.65 65.51,68.89 65.51,69.15 69.86,73.5 69.86,73.59 71.99,75.72 72.32,75.72 73.48,74.56 83.69,74.56 84.63,75.5 J1.7
P0.15  (via drill 0.15)
  Top 0.152: U1.H4 59.17,62.74 59.15,62.72 59.45,62.72 v60,62.16
  Route8 0.152: v90.08,62.39 90.08,73.81 J1.9
  Bottom 0.152: v60,62.16 89.84,62.16 v90.08,62.39
P0.16  (via drill 0.15)
  Top 0.152: J1.11 91.36,80.58 91.39,80.6 91.39,58.5 90.86,57.98 86.09,62.74 v85.09,62.74 | v59.3,62.03 58.77,62.56 U1.H3
  Bottom 0.152: v85.09,62.74 60.01,62.74 v59.3,62.03
P0.18
  Top 0.152: J1.13 84.42,81.7 84.42,67.42 77.92,60.91 59.26,60.91 59.26,61.2 58.37,62.09 U1.H2
P0.28  (via drill 0.15)
  Top 0.152: J1.15 84.42,84.24 84.42,82.66 83.77,82 78.73,82 77.56,80.84 77.11,80.84 65.33,69.06 v65.1,69.06 | v58.67,67.36 58.77,67.26 U1.A3
  Bottom 0.152: v65.1,69.06 59.74,69.06 58.71,68.03 58.71,67.4 v58.67,67.36
P0.29  (via drill 0.15)
  Top 0.152: v59.23,67.22 59.17,67.16 U1.A4
  Bottom 0.152: J1.17 84.42,86.78 84.42,85.2 83.77,84.54 82.53,84.54 65.21,67.22 v59.23,67.22
P$1  (via drill 0.15, 0.15 layers 1-10)  (1 unrouted)
  Top 0.152: U1.C5 U1.C4 59.05,65.44 59.05,65.05 58.99,64.98 | U1.E3 58.82,64.82 | 58.99,64.98 58.82,64.82 | 58.99,64.98 v59.12,64.85 59.57,64.4 U1.F5 | U1.D2 58.4,65.13 | 58.4,65.13 58.72,64.82 58.82,64.82 | C3.2 49.97,63.44 C4.2 48.97,62.43 48.97,62.39 44.98,58.41 41.26,58.41 41.16,58.51 41.16,58.55 C1.1 41,54.09 42.74,52.35 43.87,52.35 44.23,52.71 44.04,52.9 U$7.P$2 45.68,53.63 46.71,52.6 47.13,53.02 47.13,53.78 | C3.2 | C2.2 45.92,72.36 48.93,72.36 49.03,72.25 49.03,72.24 U$2.P$4 49.91,71.37 v50.35,71.37 | v51.2,65.14 50.24,65.14 C3.2 | v58.21,64.79 58.4,64.98 58.4,65.13 | U$27.P$3 59.34,69.65 v59.11,69.42
  Route8 0.152: v59.11,69.42 59.97,68.55 59.97,67.39 59.12,66.53 v59.12,64.85
  Route10 0.152: v53.16,65.18 56.73,65.18 56.98,64.92 58.08,64.92 v58.21,64.79
  Bottom 0.152: v50.35,71.37 51.75,69.97 51.75,65.36 | 51.75,65.36 51.53,65.14 v51.2,65.14 | 51.75,65.36 52.98,65.36 v53.16,65.18
RESET
  Top 0.102: U1.H1 57.97,58.27 J3.1
SCLK  (via drill 0.15)  (1 unrouted)
  Top 0.152: J1.4 69.45,70.42 v68.53,71.34
  Bottom 0.152: v68.53,71.34 66.91,72.96 59.51,72.96 59.51,78.85 v59.72,79.06
SCLK-SMALLPCB  (via drill 0.15 pad 0.46)
  Top 0.102: U2.H2 7.33,3.12 6.63,3.12 6.63,3.2 v6.58,3.25
  Bottom 0.102: v6.58,3.25 6.58,3.58 6.13,4.03 U$8.SCLK
SWDCLK
  Top 0.152: J1.20 60.17,68.83 56.27,68.84 56.3,64.17 56.31,64.16 56.51,64.36 U1.F1
SWDCLK-SMALLPCB  (via drill 0.15)
  Top 0.102: U2.F1 6.46,4.36 v6.45,4.37
  Route12 0.102: v6.45,4.37 6.15,4.06 6.15,1.27
  Route12 0.203: 6.15,1.27 16.59,1.27 J2.1
SWDIO  (via drill 0.15)
  Top 0.152: J1.18 62.71,67 62.71,61.63 61.26,61.61 v61.25,61.63 | v55.88,62.55 57.29,63.96 U1.G1
  Bottom 0.152: v61.25,61.63 56,61.63 55.8,61.83 55.88,61.91 v55.88,62.55
SWDIO-SMALLPCB  (via drill 0.15)
  Top 0.102: U2.G1 7.29,3.89 v6.86,3.89
  Route12 0.102: v6.86,3.89 6.86,3.51 6.96,3.41 6.96,1.78
  Route12 0.203: 6.96,1.78 11.86,1.78 14.7,4.61 J2.2
VCC  (via drill 0.15, 0.15 pad 0.46)
  Top 0.102: C6.2 9.63,8.64 U$10.P$3 8.88,8.52 v8.87,8.51
  Top 0.152: U2.A7 10.04,6.63 v10.05,6.99 | U2.H7 10.04,3.56 v10.26,3.33
  pour Route8: 2,2 11,2 11,11 2,11
VDD  (via drill 0.15)
  Top 0.152: U1.H7 60.98,63.56 61,63.53 61.34,63.53 62.27,63.51 62.27,64.89 61.58,65.15 U1.A7 60.75,66.74 v60.81,66.74 | C1.2 41.46,63.41 v47.45,69.39 | v48.24,70.84 48.68,71.28 48.68,71.71 | v49.19,71.21 48.68,71.71 | 48.68,71.71 U$2.P$3
  Route12 0.152: v60.81,66.74 58.33,66.74 58.23,66.65 55.22,66.65 55.04,66.83 53.56,66.83 v49.19,71.21
  Bottom 0.152: v47.45,69.39 47.45,70.05 v48.24,70.84
VDDIO_ADXL  (via drill 0.15)
  Top 0.152: U$1.VDD/IO 62.24,80.78 v62.24,81.62
  Bottom 0.152: J1.19 84.88,90.74 83.77,91.86 72.48,91.86 v62.24,81.62
VS_ADXL  (via drill 0.15)
  Top 0.152: J1.2 68.69,67.88 v66.77,69.81 | v57.39,75.53 57.39,79.06 60.63,82.3 64.17,82.3 64.2,82.27 64.1,82.17 U$1.VS
  Bottom 0.152: v66.77,69.81 65.11,71.47 58.22,71.47 58.22,74.7 v57.39,75.53
VSS_PA
  Top 0.152: U$3.GND@1 U$3.GND@2 35.9,67.94 U$4.P$1
XC1  (via drill 0.15 layers 1-4)
  Top 0.152: U$7.P$1 43.8,55.37 45.25,56.81 | 45.25,56.81 U$5.1 | U1.B2 58.12,65.96 58.04,66.04 57.53,66.04 57.32,65.83 56.98,65.83 56.75,66.07 56.75,66.41 56.77,66.43 v56.77,66.81 | v44.32,56.91 44.42,56.81 45.25,56.81
  Route4 0.152: v56.77,66.81 48.41,58.45 47.76,58.45 47.67,58.36 43.92,58.36 43.92,57.31 v44.32,56.91
XC1-SMALLPCB  (via drill 0.15)
  Top 0.102: U$17.1 3.56,2.87 3.4,2.87 | 3.4,2.87 2.7,2.87 U$19.P$1 | U2.B2 7.45,5.64 6.71,5.64 6.55,5.49 v6.55,5.41 | v2.87,2.34 3.4,2.87
  Route12 0.102: v6.55,5.41 3.5,2.36 2.9,2.36 v2.87,2.34
XC2  (via drill 0.15 layers 1-10)
  Top 0.152: U1.A1 57.27,66.36 v57.15,66.24 | v47.93,58.04 46.82,58.04 U$5.3 46.87,57.82 48.33,56.36 46.88,54.92 U$6.P$1
  Route8 0.152: v57.15,66.24 48.95,58.04 v47.93,58.04
XC2-SMALLPCB  (via drill 0.15)
  Top 0.102: U$18.P$1 5.66,3.19 U$17.3 4.45,4.4 v4.45,4.47 | v6.91,6.07 7.08,6.07 U2.A1
  Route12 0.102: v4.45,4.47 6.15,6.17 6.76,6.17 6.86,6.07 v6.91,6.07

### Text on the board
tDocu: BIGPCB | SMALL PCB